# EAGLE board FDT_Main_2021pb2 (EAGLE 7.6.0), part 1 of 2
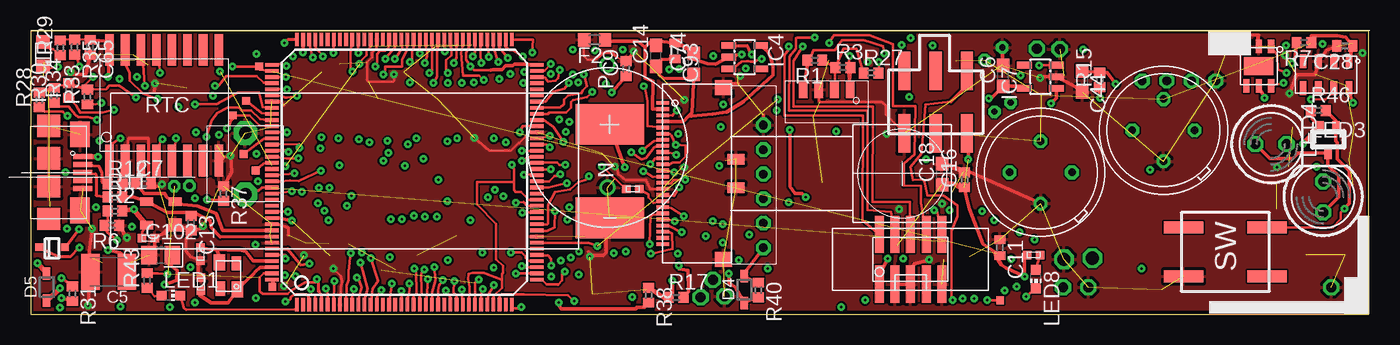
[diagram p5: board, top side]
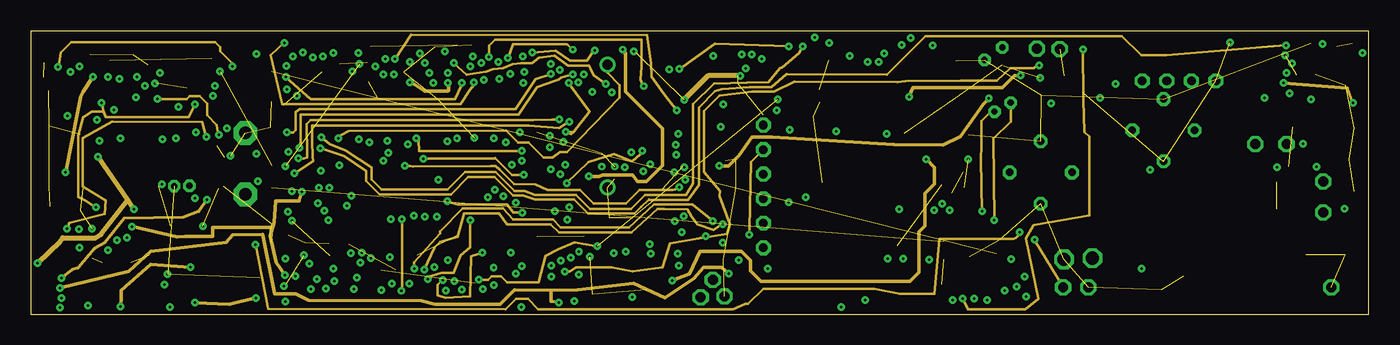
[diagram p6: board, inner layer UpGnd]
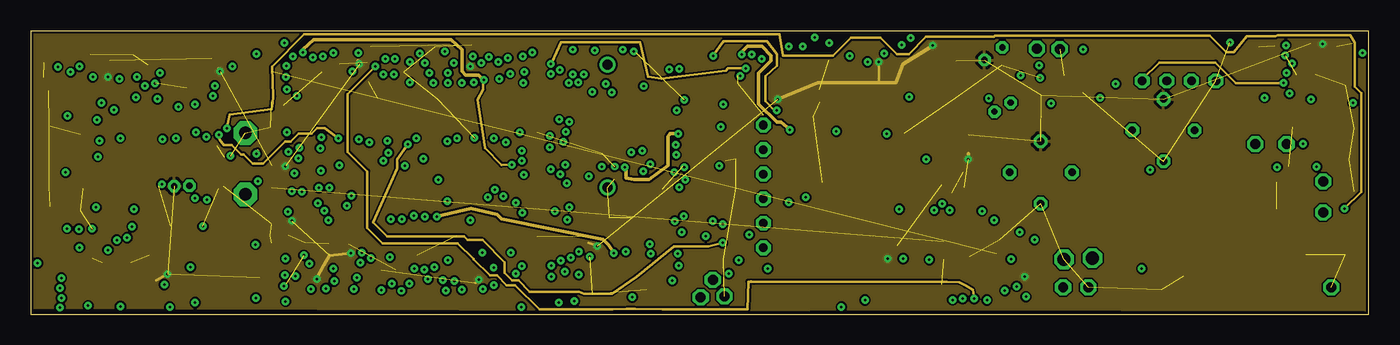
[diagram p7: board, inner layer UpSig]
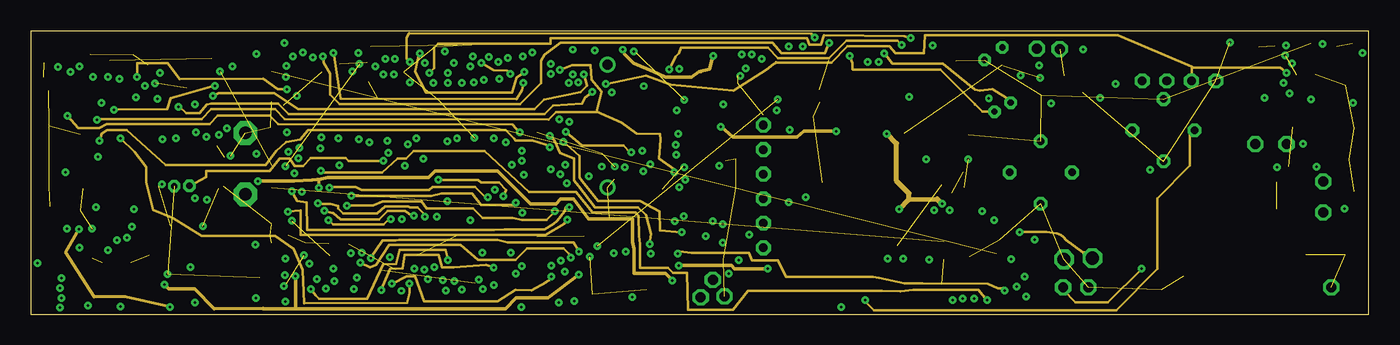
[diagram p8: board, inner layer LoSig]
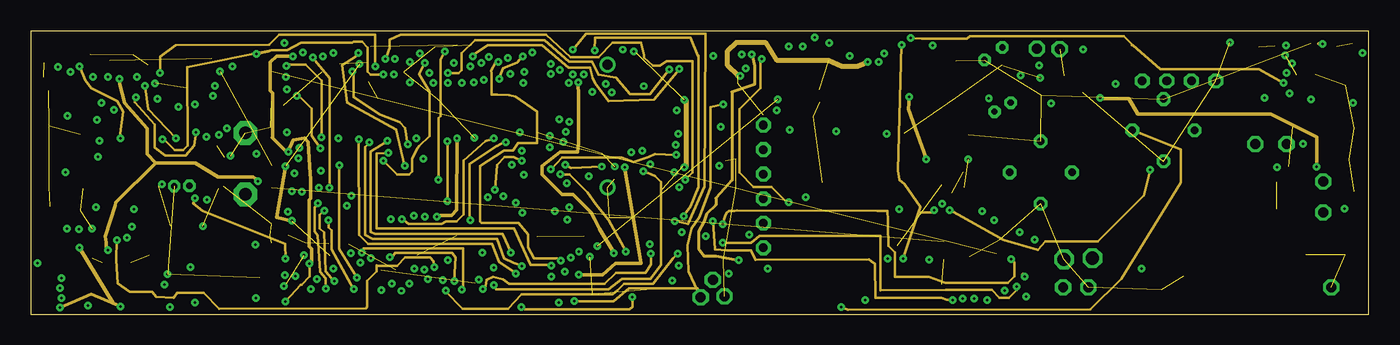
[diagram p9: board, inner layer LoPwr]
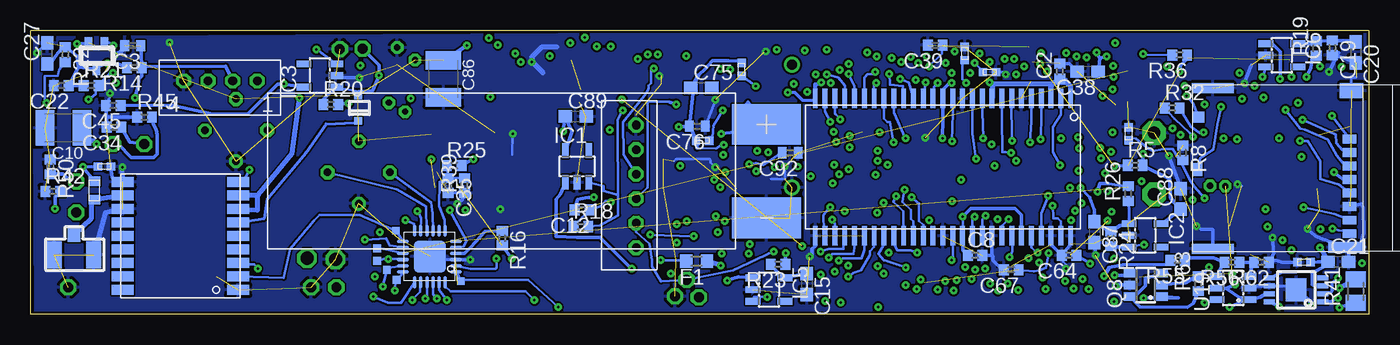
[diagram p10: board, bottom side, seen from below]

Size 108.97 x 23.11 mm. Coordinates in mm from the lower left corner, seen from the top.
Outline: 108.97,0 108.97,23.11 0,23.11 0,0 108.97,0
Copper layers (1*2*3*14*15*16): Top 0.035mm / dielectric 1.5mm / UpGnd 0.035mm / dielectric 1.5mm / UpSig 0.035mm / dielectric 1.5mm / LoSig 0.035mm / dielectric 1.5mm / LoPwr 0.035mm / dielectric 1.5mm / Bottom 0.035mm
Design rules "default *": minimum track width 4mil, minimum drill 8mil, track to track 6mil, track to pad 6mil, pad to pad 6mil, via to via 6mil, smd to smd 2mil, copper to edge 8mil, drill to drill 10mil, minimum pad ring 10mil, minimum via ring 8mil, stop-mask expansion 4mil, vias tented up to drill 0mil, thermal gap 10mil

## Footprints (pad centres in the part's own frame; a part is rotated, then mirrored left to right if it is on the bottom)
BATT_LIPO_SM = smd 5.588 x 3.302: N 2.54,-3.81; P 2.54,3.81
BATT_COIN_BR1225 = drill 0.8: NEG 0,0; PLUS 10,0
C0402 = smd 0.8 x 0.9: 1 -0.6,0; 2 0.6,0
C0402' = smd 0.7 x 0.9: 1 -0.65,0; 2 0.65,0
SMD_0402 = smd 0.686 x 0.686: P$1 -0.533,0; P$2 0.533,0
C1210K = smd 1.5 x 2.9: 1 -1.5,0; 2 1.5,0
C0603 = smd 1.1 x 1: 1 -0.85,0; 2 0.85,0
C0805ELEC = smd 1.3 x 1.5: 1P 0.95,0; 2N -0.95,0
TVSDIODE = smd 1.05 x 1.05: P$1 0,0 | smd 0.7 x 1.05: P$2 1.92,0; P$3 1.92,2.3; P$4 0,2.3
SOD323 = smd 0.625 x 0.625: A -1.1,0; K 1,0
SOD323' = smd 1 x 0.6: 1_K -1.1,0; 2_A 1.1,0
R0603 = smd 1 x 1.1: 1 -0.85,0; 2 0.85,0
GPS_ANTE = smd 2.2 x 1.2: P$1 0,-1.6; P$2 0,1.6 | smd 1.1 x 1: P$3 1.6,0
SOT23-5 = smd 0.55 x 1.2: 1 -0.95,-1.3; 2 0,-1.3; 3 0.95,-1.3; 4 0.95,1.3; 5 -0.95,1.3
JTAG_KINETIS = smd 0.737 x 3.048: P$1 -2.54,-2.032; P$2 -2.54,2.032; P$3 -1.27,-2.032; P$4 -1.27,2.032; P$5 0,-2.032; P$6 0,2.032; P$7 1.27,-2.032; P$8 1.27,2.032; P$9 2.54,-2.032; P$10 2.54,2.032
CONN_FPC_24PIN = smd 0.3 x 1: P1 5.75,0.5; P2 5.25,0.5; P3 4.75,0.5; P4 4.25,0.5; P5 3.75,0.5; P6 3.25,0.5; P7 2.75,0.5; P8 2.25,0.5; P9 1.75,0.5; P10 1.25,0.5; P11 0.75,0.5; P12 0.25,0.5; P13 -0.25,0.5; P14 -0.75,0.5; P15 -1.25,0.5; P16 -1.75,0.5; P17 -2.25,0.5; P18 -2.75,0.5; P19 -3.25,0.5; P20 -3.75,0.5; P21 -4.25,0.5; P22 -4.75,0.5; P23 -5.25,0.5; P24 -5.75,0.5 | smd 0.85 x 1.4: P$25 -1.175,-5.46; P$26 1.175,-5.46 | smd 1.22 x 1.4: P$27 -7,-4.45; P$28 7,-4.45
MICRO_SD_HORIZ = smd 0.7 x 1.1: 1_DAT2 4.45,-1.05; 2_CD_DAT3 5.55,-1.05; 3_CMD 6.65,-1.05; 4_VDD 7.75,-1.05; 5_CLK 8.85,-1.05; 6_VSS 9.95,-1.05; 7_DAT0 11.05,-1.05; 8_DAT1 12.15,-1.05 | smd 1.05 x 0.78: CD1 6.925,-13.44 | smd 0.9 x 0.93: CD2 2.66,-13.365 | smd 1.2 x 1.9: G1 0.5,-0.9 | smd 0.8 x 3.4: G2 0.3,-12.2; G3 13.4,-12.2 | smd 0.9 x 3: G4 13.3,-1.3
USB_MICRO_2019SMT = smd 2.1 x 1.6: G1 -3.1,2.55; G2 3.1,2.55 | smd 1.8 x 1.9: G3 -3.8,0; G4 -1.15,0; G5 1.15,0; G6 3.8,0 | smd 0.4 x 1.55: P1 -1.3,2.775; P2 -0.65,2.775; P3 0,2.775; P4 0.65,2.775; P5 1.3,2.775
HDR_PGM_TINY_SMT = smd 3.15 x 1: 1_VCC -2.54,-2.54; 2_RST_PGM 2.54,-2.54; 3__NC -2.54,0; 4__NC 2.54,0; 5__GND -2.54,2.54; 6__NC 2.54,2.54
CONN_4PCABLE = drill 0.7 octagon: P1 6,0; P2 4,0; P3 2,0; P4 0,0
CONN_6PCABLE = drill 0.7 octagon: P$1 0,0; P$2 2,0; P$3 4,0; P$4 6,0; P$5 8,0; P$6 10,0
SMD_IND = smd 0.762 x 0.94: P$1 -0.762,0; P$2 0.762,0
CHIP-LED0603 = smd 0.8 x 0.8: A 0,-0.75; C 0,0.75
LED_RA_SM = smd 1.1 x 1.1: 1_A -1,0; 2_K 1,0
LED5MM = drill 0.813 octagon: A -1.27,0; K 1.27,0
PIR_4P = drill 0.61 pad 0.864 octagon: DL 2.54,0; SI -2.54,0; VDD 0,2.54; VSS 0,-2.54
SOT23_PFET = smd 0.6 x 1: 1_G 0.65,0.83; 2_S -0.65,0.83; 3_D 0,-1.27
SSOT6 = smd 0.69 x 0.99: 1 -0.95,-1.3; 2 0,-1.3; 3 0.95,-1.3; 4 0.95,1.3; 5 0,1.3; 6 -0.95,1.3
R0402 = smd 0.8 x 0.9: 1 -0.6,0; 2 0.6,0
M0805 = smd 1.3 x 1.6: 1 -0.95,0; 2 0.95,0
SW_SQ = drill 1.016 pad 1.93 octagon: P$1 -2.5,0; P$2 2.5,0
TESTP_SM = drill 0.813 pad 1.321 octagon: P$1 0,0
TP_SMT = smd 0.635 x 0.635: P$1 0,0
TP_THSM = drill 0.508 octagon: P$1 0,0
TP_THSM2 = drill 1.067 pad 1.524 octagon: P$1 0,0
ALTIMETER_MPL = smd 0.55 x 1.15: P$1 -1.875,-1.1; P$2 -0.625,-1.1; P$3 0.625,-1.1; P$4 1.875,-1.1; P$5 1.875,1.1; P$6 0.625,1.1; P$7 -0.625,1.1; P$8 -1.875,1.1
LQFP144 = smd 1.1 x 0.3: P$1 -10.8,8.75; P$2 -10.8,8.25; P$3 -10.8,7.75; P$4 -10.8,7.25; P$5 -10.8,6.75; P$6 -10.8,6.25; P$7 -10.8,5.75; P$8 -10.8,5.25; P$9 -10.8,4.75; P$10 -10.8,4.25; P$11 -10.8,3.75; P$12 -10.8,3.25; P$13 -10.8,2.75; P$14 -10.8,2.25; P$15 -10.8,1.75; P$16 -10.8,1.25; P$17 -10.8,0.75; P$18 -10.8,0.25; P$19 -10.8,-0.25; P$20 -10.8,-0.75; P$21 -10.8,-1.25; P$22 -10.8,-1.75; P$23 -10.8,-2.25; P$24 -10.8,-2.75; P$25 -10.8,-3.25; P$26 -10.8,-3.75; P$27 -10.8,-4.25; P$28 -10.8,-4.75; P$29 -10.8,-5.25; P$30 -10.8,-5.75; P$31 -10.8,-6.25; P$32 -10.8,-6.75; P$33 -10.8,-7.25; P$34 -10.8,-7.75; P$35 -10.8,-8.25; P$36 -10.8,-8.75; P$73 10.8,-8.75; P$74 10.8,-8.25; P$75 10.8,-7.75; P$76 10.8,-7.25; P$77 10.8,-6.75; P$78 10.8,-6.25; P$79 10.8,-5.75; P$80 10.8,-5.25; P$81 10.8,-4.75; P$82 10.8,-4.25; P$83 10.8,-3.75; P$84 10.8,-3.25; P$85 10.8,-2.75; P$86 10.8,-2.25; P$87 10.8,-1.75; P$88 10.8,-1.25; P$89 10.8,-0.75; P$90 10.8,-0.25; P$91 10.8,0.25; P$92 10.8,0.75; P$93 10.8,1.25; P$94 10.8,1.75; P$95 10.8,2.25; P$96 10.8,2.75; P$97 10.8,3.25; P$98 10.8,3.75; P$99 10.8,4.25; P$100 10.8,4.75; P$101 10.8,5.25; P$102 10.8,5.75; P$103 10.8,6.25; P$104 10.8,6.75; P$105 10.8,7.25; P$106 10.8,7.75; P$107 10.8,8.25; P$108 10.8,8.75 | smd 0.3 x 1.1: P$37 -8.75,-10.8; P$38 -8.25,-10.8; P$39 -7.75,-10.8; P$40 -7.25,-10.8; P$41 -6.75,-10.8; P$42 -6.25,-10.8; P$43 -5.75,-10.8; P$44 -5.25,-10.8; P$45 -4.75,-10.8; P$46 -4.25,-10.8; P$47 -3.75,-10.8; P$48 -3.25,-10.8; P$49 -2.75,-10.8; P$50 -2.25,-10.8; P$51 -1.75,-10.8; P$52 -1.25,-10.8; P$53 -0.75,-10.8; P$54 -0.25,-10.8; P$55 0.25,-10.8; P$56 0.75,-10.8; P$57 1.25,-10.8; P$58 1.75,-10.8; P$59 2.25,-10.8; P$60 2.75,-10.8; P$61 3.25,-10.8; P$62 3.75,-10.8; P$63 4.25,-10.8; P$64 4.75,-10.8; P$65 5.25,-10.8; P$66 5.75,-10.8; P$67 6.25,-10.8; P$68 6.75,-10.8; P$69 7.25,-10.8; P$70 7.75,-10.8; P$71 8.25,-10.8; P$72 8.75,-10.8; P$109 8.75,10.8; P$110 8.25,10.8; P$111 7.75,10.8; P$112 7.25,10.8; P$113 6.75,10.8; P$114 6.25,10.8; P$115 5.75,10.8; P$116 5.25,10.8; P$117 4.75,10.8; P$118 4.25,10.8; P$119 3.75,10.8; P$120 3.25,10.8; P$121 2.75,10.8; P$122 2.25,10.8; P$123 1.75,10.8; P$124 1.25,10.8; P$125 0.75,10.8; P$126 0.25,10.8; P$127 -0.25,10.8; P$128 -0.75,10.8; P$129 -1.25,10.8; P$130 -1.75,10.8; P$131 -2.25,10.8; P$132 -2.75,10.8; P$133 -3.25,10.8; P$134 -3.75,10.8; P$135 -4.25,10.8; P$136 -4.75,10.8; P$137 -5.25,10.8; P$138 -5.75,10.8; P$139 -6.25,10.8; P$140 -6.75,10.8; P$141 -7.25,10.8; P$142 -7.75,10.8; P$143 -8.25,10.8; P$144 -8.75,10.8
HUMIDITY_A = smd 0.5 x 1.1: P$1 -1,-1.6; P$2 0,-1.6; P$3 1,-1.6; P$4 1,1.6; P$5 0,1.6; P$6 -1,1.6 | smd 2.4 x 1.5: P$7 0,0
ALS = smd 0.7 x 1.4: P$1 -1.9,0; P$2 -0.635,0; P$3 0.635,0; P$4 1.9,0
SOIC16_RTC = smd 0.7 x 2.6: P$1 -4.445,-4.5; P$2 -3.175,-4.5; P$3 -1.905,-4.5; P$4 -0.635,-4.5; P$5 0.635,-4.5; P$6 1.905,-4.5; P$7 3.175,-4.5; P$8 4.445,-4.5; P$9 4.445,4.5; P$10 3.175,4.5; P$11 1.905,4.5; P$12 0.635,4.5; P$13 -0.635,4.5; P$14 -1.905,4.5; P$15 -3.175,4.5; P$16 -4.445,4.5
TSOP_54 = smd 0.4 x 1.6: P$1 -9.3,-5.6; P$2 -8.5,-5.6; P$3 -7.7,-5.6; P$4 -6.9,-5.6; P$5 -6.1,-5.6; P$6 -5.3,-5.6; P$7 -4.5,-5.6; P$8 -3.7,-5.6; P$9 -2.9,-5.6; P$10 -2.1,-5.6; P$11 -1.3,-5.6; P$12 -0.5,-5.6; P$13 0.3,-5.6; P$14 1.1,-5.6; P$15 1.9,-5.6; P$16 2.7,-5.6; P$17 3.5,-5.6; P$18 4.3,-5.6; P$19 5.1,-5.6; P$20 5.9,-5.6; P$21 6.7,-5.6; P$22 7.5,-5.6; P$23 8.3,-5.6; P$24 9.1,-5.6; P$25 9.9,-5.6; P$26 10.7,-5.6; P$27 11.5,-5.6; P$28 11.5,5.6; P$29 10.7,5.6; P$30 9.9,5.6; P$31 9.1,5.6; P$32 8.3,5.6; P$33 7.5,5.6; P$34 6.7,5.6; P$35 5.9,5.6; P$36 5.1,5.6; P$37 4.3,5.6; P$38 3.5,5.6; P$39 2.7,5.6; P$40 1.9,5.6; P$41 1.1,5.6; P$42 0.3,5.6; P$43 -0.5,5.6; P$44 -1.3,5.6; P$45 -2.1,5.6; P$46 -2.9,5.6; P$47 -3.7,5.6; P$48 -4.5,5.6; P$49 -5.3,5.6; P$50 -6.1,5.6; P$51 -6.9,5.6; P$52 -7.7,5.6; P$53 -8.5,5.6; P$54 -9.3,5.6
MSOP_8 = smd 0.42 x 0.89: P$1 -0.975,-2.175; P$2 -0.325,-2.175; P$3 0.325,-2.175; P$4 0.975,-2.175; P$5 0.975,2.175; P$6 0.325,2.175; P$7 -0.325,2.175; P$8 -0.975,2.175 | smd 1.88 x 1.68: P$9 0,0
UBLOX_M8 = smd 1.8 x 0.8: P$1 -4.7,4.4; P$2 -4.7,3.3; P$3 -4.7,2.2; P$4 -4.7,1.1; P$5 -4.7,0; P$6 -4.7,-1.1; P$7 -4.7,-2.2; P$8 -4.7,-3.3; P$9 -4.7,-4.4; P$10 4.7,-4.4; P$11 4.7,-3.3; P$12 4.7,-2.2; P$13 4.7,-1.1; P$14 4.7,0; P$15 4.7,1.1; P$16 4.7,2.2; P$17 4.7,3.3; P$18 4.7,4.4
SOT23-6L = smd 0.55 x 1.2: 1 -0.95,-1.3; 2 0,-1.3; 3 0.95,-1.3; 4 0.95,1.3; 5 0,1.3; 6 -0.95,1.3
QFN24 = smd 1 x 0.3: P$1 -2.1,1.25; P$2 -2.1,0.75; P$3 -2.1,0.25; P$4 -2.1,-0.25; P$5 -2.1,-0.75; P$6 -2.1,-1.25; P$13 2.2,-1.25; P$14 2.2,-0.75; P$15 2.2,-0.25; P$16 2.2,0.25; P$17 2.2,0.75; P$18 2.2,1.25 | smd 0.3 x 1: P$7 -1.25,-2.1; P$8 -0.75,-2.1; P$9 -0.25,-2.1; P$10 0.25,-2.1; P$11 0.75,-2.1; P$12 1.25,-2.1; P$19 1.25,2.1; P$20 0.75,2.1; P$21 0.25,2.1; P$22 -0.25,2.1; P$23 -0.75,2.1; P$24 -1.25,2.1 | smd 2.6 x 2.6: P$25 0,0
SWITCH = smd 1 x 3.2: P$1 -2,3.4; P$2 -2,-3.4; P$3 2,-3.4; P$4 2,3.4
XTAL_SMALL = smd 1.3 x 0.95: P$1 -1.1,-0.725; P$3 1.1,0.725 | smd 1.15 x 0.8: P$2 1.025,-0.65; P$4 -1.025,0.65

## Placement (x,y rotation side)
B1  BATT_LIPO_SM  [BATT_LIPO_SM]  44.6,11.66 0 top
B2  BATT_COIN_BR1225  [BATT_COIN_BR1225]  46.96,10.34 90 top
B3  BATT_LIPO_SM  [BATT_LIPO_SM]  51.59,11.66 0 bottom
C2  0.1uF  [C0402]  25.17,19.81 90 bottom
C3  0.1uF  [C0402']  100.66,21.89 180 bottom
C4  10pF  [SMD_0402]  19.56,14.71 90 bottom
C5  220uF  [C1210K]  6.35,3.45 180 top
C6  DNS_10uF  [C0603]  79.2,19.43 90 top
C7  47pF  [C0402]  9.19,10.64 0 top
C8  0.1uF  [C0402]  32.05,4.8 0 bottom
C9  0.1uF  [C0402]  48.49,20.02 90 top
C10  DNS_220uF_flash  [C1210K]  106.3,15.19 180 bottom
C11  0.1uF  [C0402']  78.92,5.44 270 top
C12  0.1uF  [C0402]  64.08,8.51 180 bottom
C13  47pF  [C0402]  13.06,7.42 270 top
C14  10uF  [C0603]  50.93,21.06 90 top
C15  10uF  [C0603]  45.77,2.46 270 bottom
C16  0.1uF  [C0402]  76.05,10.95 90 top
C18  10uF  [C0603]  74.22,11.4 90 top
C19  0.1uF  [C0402]  2.97,21.72 270 bottom
C20  10uF  [C0603]  1.07,21.34 270 bottom
C21  2.2uF  [C0603]  2.49,4.27 0 bottom
C22  0.1uF  [C0402]  106.48,18.64 180 bottom
C27  1.0uF  [C0603]  107.62,21.26 90 bottom
C28  0.1uF  [C0402']  107.01,21.87 180 top
C29  0.1uF  [SMD_0402]  5.28,4.24 180 bottom
C34  0.1uF  [C0402]  102.18,15.24 180 bottom
C35  0.1uF  [C0402]  74.96,10.49 270 bottom
C38  4.7Uf  [C0603]  22.89,19.78 180 bottom
C39  0.1uF  [C0402]  35.31,21.92 180 bottom
C43  18pF  [SMD_0402]  102.97,12.04 180 bottom
C44  10uF  [C0603]  85.62,18.97 270 top
C45  0.1uF  [C0402]  102.23,17.02 180 bottom
C64  0.1uF  [C0402]  24.4,4.81 180 bottom
C65  0.1uF  [C0402]  4.85,21.76 270 top
C67  0.1uF  [C0402]  29.12,3.62 180 bottom
C70  10pF  [SMD_0402]  13.87,2.45 90 top
C71  10pF  [SMD_0402]  13.82,4.89 270 top
C74  1uF  [C0603]  54,20.42 90 top
C75  1uF  [C0603]  54.36,18.45 0 bottom
C76  0.1uF  [C0402']  54.68,15.33 180 bottom
C86  220uF  [C1210K]  75.36,19.18 270 bottom
C87  10uF  [C0603]  22.35,6.68 270 bottom
C88  10uF  [C0603]  15.32,9.4 90 bottom
C89  10uF  [C0603]  64.59,16.13 0 bottom
C92  0.1uF  [C0402']  47.12,13.16 180 bottom
C93  0.1uF  [C0402']  52.45,21.46 270 top
C102  10uF  [C0805ELEC]  10.59,4.83 0 top
C155  10nF  [SMD_0402]  9.58,6.2 0 top
D1  ESD_SM  [TVSDIODE]  11.76,7.26 90 top
D2  DIO_SCH  [SOD323]  82.3,16.76 270 bottom
D3  DIO_SCH  [SOD323]  1.7,5.46 180 top
D4  DIODE_SCHTKY  [SOD323']  58.12,2.01 90 top
D5  DIODE_SCHTKY  [SOD323']  1.3,2.21 90 top
F1  [R0603]  54.74,4.32 180 bottom
F2  [R0603]  45.92,22.38 180 top
G2  GPS_ANT  [GPS_ANTE]  105.44,4.85 90 bottom
IC1  3.0  [SOT23-5]  64.48,12.05 0 bottom
IC2  3.3  [SOT23-5]  18.21,6.43 270 bottom
IC3  3.3  [SOT23-5]  85.42,19.46 90 bottom
IC4  2.8  [SOT23-5]  58.14,20.95 270 top
IC5  3.3  [SOT23-5]  48.84,2.01 270 bottom
IC6  3.3  [SOT23-5]  7.09,21.11 270 bottom
IC7  DNS_3.0  [SOT23-5]  82.22,19.35 90 top
J1  JTAG_KINETIS  [JTAG_KINETIS]  71.65,4.47 0 top
J2  CONN_FPC_24P  [CONN_FPC_24PIN]  51.97,11.47 90 top
J3  MICRO_SD_HORIZ  [MICRO_SD_HORIZ]  0.51,18.73 270 bottom
J4  USB_MICRO_SMT  [USB_MICRO_2019SMT]  1.47,11.56 270 top
J5  HDR_PGM_TINY_SMT  [HDR_PGM_TINY_SMT]  73.69,17.29 90 top
J6  CONN_4PCABLE_VERT  [CONN_4PCABLE]  96.52,19.02 0 bottom
J7  CONN_6P_VERT  [CONN_6PCABLE]  59.66,15.42 270 bottom
L5  100nH  [SMD_IND]  103.78,10.08 270 bottom
LED1  [CHIP-LED0603]  11.43,1.52 270 top
LED2  LED_RA_SM  [LED_RA_SM]  1.02,21.18 270 top
LED3  [LED5MM]  101,13.86 0 top
LED4  [LED5MM]  105.25,9.56 90 top
LED8  [CHIP-LED0603]  81.86,2.87 180 top
PIR1  PIR_DUAL_4P  [PIR_4P]  92.25,15 0 top
PIR2  PIR_DUAL_4P  [PIR_4P]  82.25,11.56 0 top
Q1  MOSFET_P  [SOT23_PFET]  105.64,14.43 0 top
Q5  MOSFET_P  [SOT23_PFET]  103.61,21.26 0 bottom
Q8  FET_PAIR  [SSOT6]  18.16,2.39 90 bottom
R1  4.7K  [R0402]  63.86,20.7 180 top
R2  DNS_1M  [R0402]  6.86,8.41 0 top
R3  4.7K  [R0402]  66.14,20.12 0 top
R5  0  [R0402]  19.02,12.14 0 bottom
R6  DNS_2.2M  [R0402]  6.6,7.24 180 top
R7  0  [R0402]  103.68,22.15 180 top
R8  5.62K_1%  [R0402]  15.14,13.16 270 bottom
R9  2.7K  [SMD_0402]  54.25,14.15 0 bottom
R10  2.7K  [SMD_0402]  51.08,19.96 270 bottom
R11  27  [R0402]  6.86,9.55 0 top
R12  27  [R0402]  6.88,10.62 0 top
R13  27  [SMD_0402]  49.02,10.21 180 top
R14  0  [R0402]  100.53,20.12 180 bottom
R15  0  [R0402]  87.05,19.1 90 top
R16  0  [R0402]  70.56,6.2 270 bottom
R17  0  [R0402]  52.55,1.37 0 top
R18  100  [R0402]  64.16,7.14 0 bottom
R19  0  [R0402]  4.29,21.67 90 bottom
R20  DNS_0  [R0402]  84.53,17.09 0 bottom
R21  4.7K  [R0402]  104.04,18.64 0 bottom
R22  4.7K  [R0402]  106.15,21.16 270 bottom
R23  0  [R0402]  48.11,4.06 180 bottom
R24  10K  [R0402]  21.01,6.15 270 bottom
R25  1.5M  [R0402]  74.47,12.12 0 bottom
R26  0  [R0402]  19.58,9.83 90 bottom
R27  0  [R0402]  68.43,19.66 0 top
R28  100K  [R0402]  0.71,17.48 90 top
R29  330  [R0402]  2.41,21.72 90 top
R30  100K  [R0402]  1.91,17.86 90 top
R31  10K  [R0402]  3.4,1.68 270 top
R32  100K  [R0402]  16,16.81 0 bottom
R33  100K  [R0402]  4.62,17.7 90 top
R34  10K  [R0402]  3.1,18.24 90 top
R35  4.7K  [R0402]  3.58,21.77 270 top
R36  4.7K  [R0402]  15.39,21.13 180 bottom
R37  10K_NTC  [R0402]  15.7,9.83 270 top
R38  0  [R0402]  50.32,1.55 270 top
R39  2.2M  [R0402]  73.64,10.49 90 bottom
R40  0  [R0402]  59.26,1.98 270 top
R41  7.5_0p25W_0805  [M0805]  1.07,1.88 90 bottom
R42  20  [R0402]  107.16,10.01 0 bottom
R43  330  [R0402]  9.48,2.75 90 top
R44  1K  [SMD_0402]  32.9,21.24 270 bottom
R45  20  [R0402]  99.69,16.05 0 bottom
R46  1M  [R0402]  104.85,16.61 0 top
R50  20  [R0402]  107.37,12.01 270 bottom
R53  1K  [SMD_0402]  30.89,19.73 180 bottom
R55  360K  [R0402]  15.57,4.39 180 bottom
R56  510K  [R0402]  11.15,4.24 180 bottom
R62  110K  [R0402]  8.74,4.24 180 bottom
R63  1M  [R0402]  13.89,2.49 90 bottom
R65  330  [SMD_0402]  81.66,4.83 0 top
SW1  SWITH_NO  [SW_SQ]  17.48,12.27 90 top
T2  [TESTP_SM]  105.91,2.18 90 top
T3  [TESTP_SM]  86.13,2.18 0 top
T4  [TESTP_SM]  54.56,1.37 90 top
T5  [TESTP_SM]  56.49,1.46 0 top
T6  [TESTP_SM]  84.07,2.18 0 top
T7  [TESTP_SM]  55.55,2.79 0 top
T12  [TESTP_SM]  83.79,21.62 0 top
T13  [TESTP_SM]  81.94,21.64 0 bottom
TP1  TP_SMT  [TP_SMT]  17.55,17.4 0 top
TP2  TP_SMT  [TP_SMT]  79.22,6.81 0 bottom
TP3  TP_THSM  [TP_THSM]  78.49,16.51 0 top
TP4  TP_SMT  [TP_SMT]  80.75,5.36 0 bottom
TP5  TP_THSM  [TP_THSM]  77.67,20.73 0 top
TP6  TP_SMT  [TP_SMT]  73.94,2.69 0 bottom
TP7  TP_THSM  [TP_THSM]  12.93,10.46 0 top
TP8  TP_THSM  [TP_THSM]  79.12,21.74 0 top
TP9  TP_THSM  [TP_THSM]  11.68,10.44 0 top
TP10  TP_SMT  [TP_SMT]  19.68,2.24 0 top
TP11  TP_THSM  [TP_THSM]  79.81,17.25 0 top
TP12  TP_THSM2  [TP_THSM2]  84.15,4.47 0 top
TP13  TP_THSM2  [TP_THSM2]  86.46,4.57 0 top
TP15  TP_SMT  [TP_SMT]  18.31,11.71 0 top
TP16  TP_SMT  [TP_SMT]  16.46,16.21 0 top
TP17  TP_SMT  [TP_SMT]  17.35,13.06 0 top
TP18  TP_SMT  [TP_SMT]  18.59,20.19 0 top
TP24  TP_SMT  [TP_SMT]  79.96,3.61 0 bottom
TP26  TP_SMT  [TP_SMT]  79.17,2.79 90 bottom
TP27  TP_SMT  [TP_SMT]  80.75,4.34 0 bottom
TP29  TP_SMT  [TP_SMT]  78.94,1.14 0 top
U1  ALTIMETER_NXP  [ALTIMETER_MPL]  105.49,19.53 180 top
U2  ATSAMV71_144  [LQFP144]  30.43,11.58 90 top
U4  HUMIDITY_A  [HUMIDITY_A]  100,20.22 180 top
U5  ALS  [ALS]  64.82,18.31 180 top
U6  RTC_2019  [SOIC16_RTC]  10.87,17.04 0 top
U7  SRAM_16M_2X16  [TSOP_54]  33.58,11.99 180 bottom
U9  [MSOP_8]  5.92,1.98 90 bottom
U11  UBLOX_M8  [UBLOX_M8]  96.77,6.38 180 bottom
U19  LTC1998  [SOT23-6L]  11.05,2.13 90 bottom
U24  ATTINY_817_QFN  [QFN24]  76.45,4.7 180 bottom
U$1  [SWITCH]  97.28,5.08 90 top
X3  12MHz  [XTAL_SMALL]  16.11,3.11 90 top

## Tracks (layer width: path | path; a pad name or v marks a point on that pad's centre or on a via)
A0  (via drill 0.2 pad 0.46)
  Top 0.203: v20.85,14.83 U2.P$120
  UpGnd 0.203: v42.37,19.58 41.12,19.18 39.47,16.74 21.89,16.74 21.57,16.48 21.57,15.01 21.36,14.81 20.88,14.81 v20.85,14.83
  Bottom 0.203: U7.P$23 41.88,18.61 v42.37,19.58
A1  (via drill 0.2 pad 0.46)
  Top 0.203: v21.87,13.56 21.87,13.87 19.64,13.84 U2.P$122
  UpGnd 0.203: v44.15,19.56 43.2,19.3 43,19.13 42.75,19.05 41.25,18.49 39.73,16.26 21.97,16.26 22,14.05 21.89,13.64 v21.87,13.56
  Bottom 0.203: U7.P$24 42.68,18.55 42.65,18.64 43.18,19.3 v44.15,19.56
A2  (via drill 0.2 pad 0.46)
  Top 0.203: v21.79,12.7 20.88,12.68 19.65,12.85 U2.P$124
  UpGnd 0.203: v43.03,15.88 42.44,15.85 40.89,15.82 22.81,15.82 22.45,15.52 22.45,14.3 22.5,14.2 22.53,12.78 22.23,12.7 22,12.65 v21.79,12.7
  Bottom 0.203: U7.P$25 43.48,16.55 43.48,16.36 43.41,16.26 v43.03,15.88
A3  (via drill 0.2 pad 0.46)
  Top 0.203: v21.49,11.48 19.66,11.3 U2.P$127
  UpGnd 0.203: v43.84,15.7 43.03,15.19 40.54,15.37 22.91,15.37 22.91,14.1 22.96,12.85 22.99,12.47 v21.49,11.48
  Bottom 0.203: U7.P$26 44.28,16.52 v43.84,15.7
A4_SPICLK1  (via drill 0.2 pad 0.46)
  Top 0.203: v21.26,10.01 U2.P$130
  LoSig 0.203: v43.87,8.74 43.59,8.74 43.48,8.38 42.88,7.62 42.57,7.34 41.83,6.91 38.61,6.91 37.74,6.88 22.53,6.88 22.48,9.09 21.72,9.25 v21.26,10.01
  Bottom 0.203: U7.P$29 44.35,7.31 44.4,7.54 44.4,8.08 v43.87,8.74
A5_CPICS  (via drill 0.2 pad 0.46)
  Top 0.203: v20.95,8.36 19.65,8.36 U2.P$133
  LoSig 0.203: v43.71,7.7 43.61,7.62 43.56,7.54 43.43,7.34 41.94,6.45 38.79,6.45 37.87,6.48 22,6.48 22,8.46 v20.95,8.36
  Bottom 0.203: U7.P$30 43.48,6.98 43.46,7.37 43.69,7.64 v43.71,7.7
A6_MISO1  (via drill 0.2 pad 0.46)
  Top 0.203: v27.69,4.57 28.3,2.72 27.84,2.06 U2.P$13
  LoSig 0.203: v44.65,5.11 44.22,5.87 38.84,5.87 38.02,6.07 30,6.07 29.72,6.02 28.65,6.02 v27.69,4.57
  Bottom 0.203: U7.P$31 42.78,6.13 42.8,5.31 43.97,5.31 v44.65,5.11
A7_MOSI  (via drill 0.2 pad 0.46)
  Top 0.203: v26.85,4.19 27.43,2.08 27.23,1.37 U2.P$12
  LoSig 0.203: v43.97,4.6 43.84,4.93 43.38,5.38 40.44,5.38 39.5,4.45 39.4,4.42 36.45,4.42 35.03,5.64 29.18,5.64 28.12,4.01 27.64,3.83 v26.85,4.19
  Bottom 0.203: U7.P$32 41.88,5.39 41.99,4.93 43.69,4.93 v43.97,4.6
A8  (via drill 0.2 pad 0.46)
  Top 0.203: v38.08,20.57 37.69,21.71 U2.P$76
  LoPwr 0.203: v43.18,4.37 42.88,4.55 40.97,4.55 40.51,5.44 40.51,6.5 39.73,7.44 36.7,7.44 36.6,7.54 36.6,12.09 38.53,13.36 39.29,13.36 39.7,13.97 41.25,13.97 41.25,16.54 39.5,17.75 38.94,17.86 38,17.88 37.52,17.91 37.52,19.63 37.49,19.84 37.87,20.5 v38.08,20.57
  Bottom 0.203: U7.P$33 41.08,5.25 41.3,4.55 42.82,4.55 v43.18,4.37
A9  (via drill 0.2 pad 0.46)
  Top 0.203: v29.41,2.49 29.16,0.8 U2.P$16
  LoSig 0.203: v42.39,3.05 42.44,2.92 41.81,2.52 41.99,2.59 40.79,1.96 39.5,2.01 38.02,1.07 32.03,1.07 31.32,3.1 30.61,3.1 v29.41,2.49
  Bottom 0.203: U7.P$34 40.28,5.47 40.64,5.11 40.64,4.83 41.38,3.56 41.96,3.38 v42.39,3.05
A10  (via drill 0.2 pad 0.46)
  Top 0.203: v31.67,21.26 U2.P$88
  LoSig 0.203: v40.21,19.74 39.57,19.3 39.19,18.06 32.21,18.06 31.32,19.76 31.52,20.7 v31.67,21.26
  Bottom 0.203: U7.P$22 41.08,19.3 40.82,19.56 40.34,19.56 v40.21,19.74
A11  (via drill 0.2 pad 0.46)
  Top 0.203: v28.55,1.98 28.22,1.45 28.19,0.82 28.22,0.82 U2.P$14
  LoSig 0.203: v37.69,3.81 37.08,4.01 34.42,3.81 33.5,3.81 33.22,4.83 30.45,4.83 30.28,3.73 29.26,3.71 v28.55,1.98
  Bottom 0.203: U7.P$35 39.53,5.61 39.93,4.93 39.73,4.67 39.47,4.39 39.42,4.39 v37.69,3.81
A12  (via drill 0.2 pad 0.46)
  Top 0.203: v33.55,2.77 33.27,2.34 33.17,1.93 33.22,0.83 U2.P$24
  UpGnd 0.203: v36.78,5 36.07,4.8 35.87,4.72 35.79,1.47 33.78,1.32 33.12,1.52 33.12,2.39 v33.55,2.77
  Bottom 0.203: U7.P$36 38.6,5.56 38.38,5.21 37.29,5.21 v36.78,5
AGND  (via drill 0.2 pad 0.46)
  Top 0.305: 52.23,22.19 C93.1 | J2.P2 50.72,16.71 50.65,16.74 50.67,19 50.01,19.25 50.01,21.77 | 50.01,21.77 50.43,22.19 50.8,22.19 C14.2 50.91,22.29 C93.1 | 46.85,22.28 49.4,22.28 50.01,21.77 | v57.91,21.18 57.91,21.26 57.81,21.16 57.63,21.16 IC4.2 55.77,20.4 55.12,20.42 53.87,20.83 C74.2 52.45,22.3 C93.1 | v61.82,15.04 61.82,10.41 62.26,9.86 62.79,9.86 v63.12,9.53
  Top 0.406: F2.1 46.99,22.42 46.85,22.28
  UpSig 0.305: v57.91,21.18 57.91,21.39 58.37,21.84 59.54,21.84 60.3,21.08 60.3,20.65 59.28,19.63 59.28,17.14 60.78,15.65 61.09,15.65 v61.82,15.04
  Bottom 0.305: v63.12,9.53 63.52,9.53 63.83,9.47 64.41,9.34 C12.2
ALT_PWRC  (via drill 0.2 pad 0.46)
  Top 0.203: U2.P$114 20.45,17.78 20.7,17.66 20.83,17.66 v21.67,17.78
  UpGnd 0.203: v102.21,21.92 92.48,21.11 90.45,21.11 88.88,22.68 72.87,22.68 69.72,19.53 61.57,19.56 61.54,19.56 60.33,18.52 58.55,18.52 56.31,18.36 55.73,18.19 54.41,16.84 54.41,10.52 53.54,9.32 50.39,9.32 50.37,9.35 49.68,8.74 49.71,8.74 49.17,8.2 45.39,8.2 44.25,9.35 41.07,9.35 40.11,9.68 39.27,9.68 37.77,11.18 35.64,11.18 34.21,9.75 28.42,9.75 27.33,10.85 27.33,11.68 25.53,12.88 v23.57,13.54
  LoPwr 0.203: v21.67,17.78 21.87,17.78 22.89,16.76 22.89,14.55 v23.57,13.54
  Bottom 0.203: Q5.1_G 102.58,22.11 v102.21,21.92
BA0  (via drill 0.2 pad 0.46)
  Top 0.203: v32.36,2.87 U2.P$22
  UpGnd 0.203: v35.79,7.67 35.79,5.46 35,4.78 34.44,3.38 33.45,3.38 32.36,3.05 v32.36,2.87
  LoPwr 0.203: v38.71,14.02 38.56,14.02 37.97,13.72 37.95,13.72 35.74,12.24 35.74,7.72 v35.79,7.67
  Bottom 0.203: U7.P$20 39.48,15.96 39.19,15.67 38.99,15.67 v38.71,14.02
BATT  (via drill 0.2 pad 0.46)
  Top 0.254: D3.A v3.94,6.93
  Top 0.305: C102.1P 11.21,4.1 11.91,3.58 11.89,2.77 v10.87,2.41 | B1.P v48.36,11.96
  UpSig 0.305: v52.73,14.71 52.07,14.71 51.89,14.48 51.89,12.14 50.37,11 49.12,11 48.48,11.1 48.48,11.81 v48.36,11.96
  LoSig 0.254: v11.33,0.58 7.7,1.42 5.16,1.4 2.87,5.03 v3.94,6.93
  LoSig 0.305: v44.63,3.23 42.11,1.32 39.52,1.32 38.68,0.43 21.64,0.43 | 21.64,0.43 18.95,0.43 18.95,0.48 14.96,0.46 13.34,2.08 11.23,2.08 v10.87,2.41 | v21.57,3.1 21.57,0.56 21.64,0.43
  LoPwr 0.305: v48.36,11.96 49.68,4.14 47.62,4.14 46.58,3.23 v44.63,3.23
  Bottom 0.305: U19.1 8.88,1.39 8.38,1.68 8.33,1.65 U9.P$7 | v11.33,0.58 10.49,0.91 10.52,1.26 9.78,1.22 U19.1 | U19.5 11.58,2.06 | 11.58,2.06 10.49,1.32 9.46,1.32 U19.1 | v10.87,2.41 11.63,2.11 11.58,2.06 | R55.2 16.31,4.06 20.02,4.04 21.13,3.81 v21.57,3.1 | B3.P 50.57,17.27 51.56,15.93 51.61,14.83 v52.73,14.71
BATT1  (via drill 0.2 pad 0.46)
  Top 0.305: Q1.2_S 104.34,15.9 104.34,16.52 R46.1
  Top 0.406: v103.61,13.89 103.62,13.89 Q1.2_S
  Bottom 0.406: C10.1 104.8,14.25 104.7,14.15 103.86,14.15 v103.61,13.89
BIG_TINY_CLK  (via drill 0.2 pad 0.46)
  Top 0.203: U2.P$128 20.26,10.83 21.11,10.9 21.82,10.87 v23.65,11.71 | TP29.P$1 v77.88,1.14
  LoSig 0.203: v23.65,11.71 23.65,11.63 23.75,11.56 28.6,11.56 29.9,12.7 30.56,12.7 31.17,13.31 36.96,13.31 40.59,9.96 44.42,9.96 45.77,8.31 49.25,8.31 49.48,8.03 49.53,6.38 49.61,5.71 49.61,3.79 51.92,3.79 52.3,3.35 53.44,3.35 53.52,0.36 57.2,0.36 58.42,1.91 69.32,1.91 70.84,1.88 71.88,2.01 75.64,2.01 77.19,1.98 77.85,1.12 v77.88,1.14
  Bottom 0.203: v77.88,1.14 77.88,1.22 77.27,1.83 77.27,2.54 U24.P$20
BIG_TINY_DAT  (via drill 0.2 pad 0.46)
  Top 0.203: U2.P$21 31.68,1.45 31.85,1.63 31.85,2.52 31.77,2.72 31.77,3.23 31.85,3.38 v32.05,3.63
  UpGnd 0.203: v32.05,3.63 32.89,5.44 33.35,5.89 34.75,6.3 35.31,8.23 38.15,8.23 38.79,7.32 42.32,7.32 43.03,6.68 48.92,6.68 51.03,8.59 51.59,8.59 53.49,8.56 53.82,7.98 54.3,7.32 55.6,6.88 v56.34,7.34
  LoPwr 0.203: v56.34,7.34 56.36,7.32 56.44,7.49 56.46,7.72 56.54,7.98 56.64,8.26 56.84,8.43 57.33,8.43 57.53,8.46 69.34,8.43 | 69.34,8.43 68.94,8.43 | 69.34,8.43 69.75,8.43 69.83,7.67 69.83,7.24 69.85,5.59 70.38,5.05 70.38,3.05 73.13,3.05 74.47,2.54 79.58,2.54 80.11,3.07 80.11,4.22 v79.83,4.5
  Bottom 0.203: U24.P$16 78.7,4.5 v79.83,4.5 79.93,4.6 80.7,4.34 80.82,4.42 TP27.P$1
C_HSYNC  (via drill 0.2 pad 0.46)
  Top 0.203: J2.P9 52.47,13.08 v52.55,12.98 | v42.37,11.81 41.25,11.81 U2.P$55
  LoPwr 0.203: v52.55,12.98 50.83,13.06 50.29,12.83 49.07,12.42 48.11,12.78 43.26,12.78 v42.37,11.81
C_PWRC_D  (via drill 0.2 pad 0.46)
  Top 0.203: U2.P$46 42.03,7.33 42.11,7.42 42.11,8.89 42.7,9.96 43.92,10.16 44.63,10.79 45.19,10.92 v45.47,11.23
  UpGnd 0.305: v45.47,11.23 46.28,11.23 46.58,11.35 49,11.35 49.43,10.82 50.14,10.82 51.46,12.14 51.46,15.11 48.44,18.14 48.44,21.23 v48.23,21.57
  UpSig 0.203: v60.76,16.64 60.71,16.48 59.82,17.37 59.82,19.41 60.76,20.27 60.76,21.21 59.94,22.25 56.41,22.25 v55.58,21.06
  LoSig 0.203: 48.36,21.18 v48.23,21.57
  LoSig 0.305: 54.59,19.79 54.42,19.79 | 54.42,19.79 53.82,19.33 51.71,19.33 50.7,19.76 49.1,20.45 48.36,21.18 | v55.58,21.06 55.27,19.96 54.42,19.79
  Bottom 0.203: R18.2 62.59,7.24 61.14,8.05 61.14,9.73 | 61.14,9.73 62.33,10.06 62.33,10.45 IC1.3 | 61.14,9.73 61.14,11.96 61.16,12.9 61.16,15.82 v60.76,16.64
C_PWRDN  (via drill 0.2 pad 0.46)
  Top 0.203: J2.P8 50.94,13.68 50.75,13.59 50.49,13.26 50.11,12.72 49.73,12.6 v48.92,13.18 | v43.81,18.85 43.48,18.39 42.57,18.16 41.94,17.32 U2.P$66
  UpGnd 0.203: 44.21,14.86 v43.59,14.86 44.02,14.66 44.21,14.86 | 44.21,14.86 45.49,16.54 v43.81,18.85
  LoSig 0.203: v48.92,13.18 48.82,13.18 48.26,13.74 44.88,13.74 v43.59,14.86
C_TCK0  (via drill 0.2 pad 0.46)
  Top 0.203: J2.P5 50.23,15.33 50.22,17.37 50.01,18.41 v49.91,18.59 | v37.31,20.95 37.29,21.46 37.21,21.61 37.21,22.35 U2.P$77
  UpGnd 0.203: v49.91,18.59 49.84,18.67 49.76,18.92 49.66,19.13 49.76,20.17 49.76,22.38 37.82,22.38 37.34,21.89 v37.31,20.95
  Bottom 0.203: R10.P$2 v49.91,18.59
C_TWD0  (via drill 0.2 pad 0.46)
  Top 0.203: J2.P3 52.27,16.2 v52.6,16.64 | v29.67,20.8 30.15,21.57 30.23,21.64 30.23,22.34 U2.P$91
  UpGnd 0.203: v52.6,16.64 51.59,17.93 50.57,19.38 50.52,20.47 50.19,22.73 30.96,22.78 v29.67,20.8
  Bottom 0.203: v52.6,16.64 53.37,15.39 53.44,14.45 53.72,14.45 R9.P$2
C_VSYNC  (via drill 0.2 pad 0.46)
  Top 0.203: J2.P7 50.74,14.1 v49.78,13.34 | v43.64,10.69 42.19,10.34 U2.P$52
  UpGnd 0.203: v49.78,13.34 49.63,13.01 49,12.47 48.87,12.47 47.5,13.06 45.44,12.42 v43.64,10.69
CAM_2V8_AVDD
  Top 0.305: 52.17,15.72 J2.P4 53.16,15.72 53.58,16.14 | 51.18,20.32 51.18,20.64 51.41,20.74 C93.2 | 51.18,20.32 51.18,19.53 51.53,19.19 53.67,19.23 53.99,19.55 C74.1 53.87,16.43 53.58,16.14 | IC4.5 59.99,21.45 60.2,21.08 60.43,20.27 60.43,19.51 58.04,17.35 56.67,16.46 56.34,16.43 55.52,16.33 53.81,16.14 53.58,16.14 | C14.1 51.04,20.32 51.18,20.32
CAM_3V0_DOVDD  (via drill 0.2 pad 0.46)
  Top 0.203: J2.P6 52.05,14.68 52.17,14.58 v52.53,13.82 53.31,13.77 53.31,12.85 52.83,12.37 52.27,12.37 51.98,12.18 J2.P11
  LoSig 0.305: v65.61,14.91 62.97,14.91 62.38,14.43 57.17,14.43 v56.21,15.29
  Bottom 0.203: v52.53,13.82 52.83,13.69 53.16,13.51 54.71,13.54 | R10.P$1 51.26,20.5 51.26,20.62
  Bottom 0.305: C76.2 55.12,14.96 R9.P$1 54.71,14.15 54.71,13.54 | C76.2 54.98,18.4 C75.1 54.55,19.53 54.05,19.96 53.44,20.66 52.13,20.68 51.26,20.62 51.26,20.64 | IC1.5 64.87,14.89 C89.1 v65.61,14.91 | v56.21,15.29 55.37,15.29 C76.2
CARD_DETECT_A  (via drill 0.2 pad 0.46)
  Top 0.203: U2.P$64 42.11,16.33 42.22,16.43 43.61,16.43 44.02,16.84 44.02,17.3 44.17,17.45 45.31,17.68 v45.74,18.11
  LoSig 0.203: v45.74,18.11 45.16,17.65 44.88,17.17 42.55,17.02 41.86,16.33 21.01,16.33 20.17,17.17 14.68,17.17 14.33,17.07 13.77,16.41 12.65,16.41 12.09,16.92 v12.01,16.92
  Bottom 0.203: v12.01,16.92 12.32,15.47 12.68,13.41 13.72,12.71 J3.CD1
CARD_DETECT_B  (via drill 0.2 pad 0.46)
  Top 0.203: U2.P$65 43.12,16.83 43.43,17.14 43.43,17.5 43.74,17.8 44.86,18.03 44.96,18.24 45.31,18.59 v45.06,19.53
  LoSig 0.203: v45.06,19.53 45.29,18.62 44.78,18.11 41.81,17.5 41.02,16.71 21.77,16.71 19.81,18.01 15.32,18.01 v14.83,17.78
  Bottom 0.203: v14.83,17.78 14.3,17.17 J3.CD2
CAS  (via drill 0.2 pad 0.46)
  Top 0.203: v40.06,21.03 39.32,21.49 38.99,21.51 38.68,21.82 U2.P$74
  LoPwr 0.203: v38.18,19.2 38.3,19.63 38.46,20.07 39.62,20.52 v40.06,21.03
  Bottom 0.203: U7.P$17 37.46,18.87 v38.18,19.2
CHIP_ERASE  (via drill 0.2 pad 0.46)
  Top 0.203: U2.P$87 32.18,21.67 32.28,21.51 32.28,21.03 v32.08,20.47
  LoSig 0.203: v28.73,12.5 25.91,12.5 25.65,12.75 22.78,12.75 22.2,12.09 21.51,12.09 21.08,12.68 20.27,12.68 19.46,11.68 14.28,11.68 14.28,11.18 TP7.P$1
  LoPwr 0.203: v32.08,20.47 31.65,19.58 32.49,18.14 32.49,14.53 31.65,13.69 31.5,13.56 31.06,12.68 31.06,11.63 30.81,11.38 29.84,11.38 v28.73,12.5
  Bottom 0.203: R53.P$2 31.43,19.82 v32.08,20.47
CK  (via drill 0.2 pad 0.46)
  Top 0.203: v40.01,12.5 40.06,12.47 40.41,12.83 U2.P$57
  LoPwr 0.203: v37.8,10.16 37.97,12.17 38.58,12.8 39.32,12.8 v40.01,12.5
  Bottom 0.203: U7.P$38 37.08,7.56 37.29,7.77 37.29,8.48 37.97,9.17 v37.8,10.16
CKE  (via drill 0.2 pad 0.46)
  Top 0.203: v33.71,21.41 33.66,22.36 U2.P$84
  LoSig 0.203: v38.51,9.6 38.71,10.11 38.12,10.72 36.68,10.72 36.45,10.95 33.22,10.95 v33.2,10.97
  LoPwr 0.203: v33.2,10.97 33.2,15.98 33.38,16.15 33.38,20.75 v33.71,21.41
  Bottom 0.203: U7.P$37 37.88,8.36 38.33,8.81 38.35,8.81 38.71,9.17 v38.51,9.6
CS  (via drill 0.2 pad 0.46)
  Top 0.203: v30.2,1.91 30.2,0.8 U2.P$18
  UpGnd 0.203: v30.23,7.75 30.23,1.93 v30.2,1.91
  LoPwr 0.203: v37.72,14.33 37.03,14.1 35.26,12.55 35.26,8.13 34.7,7.57 33.81,7.57 33.45,7.37 30.76,7.37 v30.23,7.75
  Bottom 0.203: U7.P$19 38.68,16.45 v37.72,14.33
D0  (via drill 0.2 pad 0.46)
  Top 0.203: v26.57,2.97 26.67,2.95 26.95,2.18 26.75,1.45 26.75,0.8 26.7,0.8 U2.P$11
  LoPwr 0.203: v25.12,12.14 25.12,5.33 v26.57,2.97
  Bottom 0.203: U7.P$2 25.08,16.27 25.73,15.26 25.73,13.21 v25.12,12.14
D1  (via drill 0.2 pad 0.46)
  Top 0.203: v39.52,3.33 U2.P$38
  LoPwr 0.203: v26.72,14.25 26.75,6.45 27.46,5.74 37.57,5.74 38.15,4.27 v39.52,3.33
  Bottom 0.203: U7.P$4 26.68,16.37 v26.72,14.25
D2  (via drill 0.2 pad 0.46)
  Top 0.203: v40.01,3.94 40.23,3.94 40.34,3.83 U2.P$39
  LoPwr 0.203: v27.58,13.99 27.23,13.64 27.23,6.48 27.84,6.15 38,6.15 38.53,4.55 39.32,4.19 v40.01,3.94
  Bottom 0.203: U7.P$5 27.48,15.74 v27.58,13.99
D3  (via drill 0.2 pad 0.46)
  Top 0.203: U2.P$40 40.55,4.33 40.31,4.57 40.31,4.7 39.95,5.05 v39.12,5.03
  LoPwr 0.203: v39.12,5.03 38.43,6.55 28.04,6.55 27.69,6.71 27.69,13.26 v29.06,14.12
  Bottom 0.203: v29.06,14.12 29.11,17.56 U7.P$7
D4  (via drill 0.2 pad 0.46)
  Top 0.203: v42.39,3.96 42.39,4.52 42.11,4.8 41.26,4.8 U2.P$41
  LoPwr 0.203: v29.13,13.16 28.93,13.16 28.17,13.08 28.17,7.01 28.42,6.99 39.34,6.99 40.69,4.01 42.32,4.01 v42.39,3.96
  Bottom 0.203: U7.P$8 29.88,15.98 29.84,13.21 29.59,13.21 v29.13,13.16
D5  (via drill 0.2 pad 0.46)
  Top 0.203: v39.98,13.31 41.21,13.31 U2.P$58
  UpGnd 0.203: v31.39,14.35 31.57,14.17 31.65,13.31 v39.98,13.31
  Bottom 0.203: U7.P$10 31.45,16.5 v31.39,14.35
D6  (via drill 0.2 pad 0.46)
  Top 0.203: v40.16,11.38 41.18,11.38 U2.P$54
  UpGnd 0.203: v31.98,12.68 37.8,12.68 37.8,12.72 39.19,11.33 40.11,11.33 v40.16,11.38
  Bottom 0.203: U7.P$11 32.28,14.71 v31.98,12.68
D7  (via drill 0.2 pad 0.46)
  Top 0.203: v40.03,8.28 41.18,8.28 U2.P$48
  UpGnd 0.203: v33.93,9.2 34.04,9.17 | 34.09,9.17 34.04,9.17 | 34.04,9.17 34.75,8.97 38.81,8.97 39.24,8.36 39.29,8.31 v40.03,8.28
  LoPwr 0.203: v33.93,14.1 v33.93,9.2
  Bottom 0.203: U7.P$13 33.88,16.39 v33.93,14.1
D8  (via drill 0.2 pad 0.46)
  Top 0.203: v22.84,2.03 22.73,1.85 23.16,1.47 23.19,0.79 U2.P$4
  LoSig 0.203: v33.96,4.39 33.93,4.57 33.78,5.23 30.05,5.23 29.77,4.09 28.7,4.06 27.38,1.27 23.5,1.27 23.19,1.55 v22.84,2.03
  Bottom 0.203: U7.P$42 33.88,4.54 v33.96,4.39
D9  (via drill 0.2 pad 0.46)
  Top 0.203: v24.03,2.08 24.11,2.03 24.18,1.6 U2.P$6
  LoSig 0.203: v32.11,7.95 32.11,8.1 31.5,8.71 30.91,8.71 30.73,8.79 28.85,8.79 28.19,8.23 25.43,8.23 25.02,8.64 25.02,8.81 24.43,8.99 23.55,8.99 v23.39,9.07
  LoPwr 0.203: v23.39,9.07 23.32,8.94 23.14,8.69 23.14,6.73 23.37,6.43 23.57,3.45 24.03,2.92 v24.03,2.08 24.03,2.01
  Bottom 0.203: U7.P$44 32.28,7.78 v32.11,7.95
D10  (via drill 0.2 pad 0.46)
  Top 0.203: v24.71,2.69 24.69,0.79 U2.P$7
  LoSig 0.203: v31.19,8.03 31.04,8.03 30.5,8.41 29.08,8.41 28.37,7.72 25.25,7.72 24.64,8.26 24.54,8.26 v23.93,8.43
  LoPwr 0.203: v23.93,8.43 23.8,8.38 23.52,8.1 23.52,7.01 23.88,6.66 24.03,3.48 v24.71,2.69
  Bottom 0.203: U7.P$45 31.48,7.74 v31.19,8.03
D11  (via drill 0.2 pad 0.46)
  Top 0.203: v26.31,2.03 26.19,1.37 26.19,0.79 U2.P$10
  LoSig 0.203: v29.34,7.75 29.21,7.8 28.73,7.32 24.61,7.32 v24.26,7.67
  LoPwr 0.203: v24.26,7.67 24.26,7.06 24.49,6.83 24.49,5.28 v26.31,2.03
  Bottom 0.203: U7.P$47 29.88,7.18 29.41,7.64 29.41,7.75 v29.34,7.75
D12  (via drill 0.2 pad 0.46)
  Top 0.203: v34.49,2.72 34.44,1.75 34.67,1.52 34.67,0.79 U2.P$27
  LoPwr 0.203: v29.26,4.65 29.44,4.65 29.67,4.98 34.31,4.98 34.59,4.65 v34.49,2.72
  Bottom 0.203: U7.P$48 29.03,5.11 v29.26,4.65
D13  (via drill 0.2 pad 0.46)
  Top 0.203: v35.1,2.01 U2.P$28
  LoPwr 0.203: v26.98,5.03 27.05,5.11 27.1,5.36 35.2,5.36 35.2,2.29 v35.1,2.01
  Bottom 0.203: U7.P$50 27.48,5.46 26.87,4.85 v26.98,5.03
D14  (via drill 0.2 pad 0.46)
  Top 0.203: v39.52,9.09 40.13,9.14 40.44,8.84 U2.P$49
  LoSig 0.203: v26.11,9.65 28.12,9.65 28.37,9.63 32.61,9.63 33.45,9.86 35.94,9.86 36.68,8.89 39.27,8.89 v39.52,9.09
  Bottom 0.203: U7.P$51 26.68,8.22 v26.11,9.65
D15  (via drill 0.2 pad 0.46)
  Top 0.203: v42.7,8.38 42.65,7.06 42.06,6.78 41.28,6.78 U2.P$45
  LoSig 0.203: v25.73,8.87 27.86,8.87 28.68,9.2 31.85,9.2 32.26,8.61 36.02,8.61 36.78,7.85 39.24,7.85 40.03,7.67 42.01,7.67 v42.7,8.38
  Bottom 0.203: U7.P$53 25.08,7.58 25.32,7.82 25.7,7.82 v25.73,8.87
DISABLE_PWR  (via drill 0.2 pad 0.46)
  UpGnd 0.203: v18.31,5.69 19.33,0.43 38.66,0.38 39.52,1.27 40.51,1.27 41.3,0.38 49.89,0.41 57.2,0.38 58.19,0.84 58.42,0.84 59.66,2.08 59.94,2.08 68.63,2.06 68.71,2.06 70.79,1.68 73.61,1.68 73.99,6.15 80.01,6.15 80.21,6.22 80.37,6.33 v80.54,6.71
  LoSig 0.203: v80.54,6.71 82.7,6.71 83.57,6.6 83.9,6.45 84.12,6.25 84.3,6.07 85.7,5.03 86,5.03 TP13.P$1
  Bottom 0.203: IC2.3 v18.31,5.69
  Bottom 0.305: R24.2 20.53,5.48 IC2.3
DM
  Top 0.305: R12.2 C7.1 9.25,9.86 10.92,9.86 11.08,9.57 11.35,9.32 11.5,9.22 D1.P$2 12.03,8.99 13.56,8.81 15.09,8.2 15.65,6.83 U2.P$136
DP
  Top 0.305: U2.P$137 15.44,6.31 14.71,7.06 14.61,7.64 13.59,8.13 13.26,8.28 | 13.26,8.28 11.1,8.28 D1.P$3 8.36,9.56 R11.2 | C13.1 13.34,7.8 13.26,8.28
DVDD_REF  (via drill 0.2 pad 0.46)
  Top 0.203: J2.P10 50.86,12.68 v50.47,12.22
  Bottom 0.203: v50.47,12.22 50.39,12.27 49.91,12.34 49.29,12.17 47.98,13.06 47.6,13.16 C92.2
FRM_GPS
  Bottom 0.203: U24.P$13 TP2.P$1 82.19,8.1 85.42,8.1 85.87,7.65 87.86,5.31 88.37,2.95 U11.P$2
GND  (via drill 0.2 pad 0.46)  (79 unrouted)
  Top 0.203: U2.P$95 28.18,21.73 27.79,21.34 27.79,20.95 27.38,20.55 27.38,19.1 27.53,18.95 29.52,18.95 29.59,19.02 v29.59,19.56 | U2.P$8 25.18,1.29 25.25,1.37 25.25,2.13 25.38,2.67 25.22,3.12 v24.64,3.71 | 40.39,14.48 40.49,14.81 40.69,14.83 U2.P$61 40.59,14.83 40.51,14.76 40.51,14.68 39.78,13.95 39.73,13.95 39.12,13.34 37.31,13.34 v36.14,14.38 | J2.P15 50.42,10.22 50.11,10.92 48.44,10.95 47.83,11.43 47.78,11.86 v47.55,12.04 | 68.15,21.21 v68.15,20.57 | v53.24,11.96 53.14,12.06 53.19,12.12 | U5.P$3 64.19,17.4 64.26,17.3 69.32,17.3 69.65,16.99 69.65,16.25 J5.5__GND 69.79,14.75 v69.72,14.71 | 20.12,7.34 U2.P$135 | C9.2 48.14,20.61 47.68,21.08 47.6,21.08 47.37,21.31 46.61,21.31 46.3,21.01 46.2,20.95 45.9,20.75 45.36,20.75 45.03,21.08 45.03,22.34 F2.2
  Top 0.254: C71.P$2 13.04,4.66 | 12.65,5.11 12.65,6.13 C13.2 | 9.6,11.12 9.6,14.33 7.95,14.33 U6.P$2 | 20.12,7.34 20.95,7.06 20.95,6.43 | U4.P$2 99.92,22.1 99.92,22.73 98.04,22.73 97.66,22.35 v97.66,22.15
  Top 0.305: C70.P$2 13.64,3.35 13.64,4.23 C71.P$2 | v5,6.96 4.78,5.16 4.78,4.57 5,4.57 C5.2 5,2.46 4.72,2.18 4.72,1.7 v4.67,0.69 | C102.2N 9.77,4.71 10.08,5.03 10.08,5.82 C155.P$2 10.29,6.33 10.95,6.63 | 11.38,7.19 D1.P$1 12.94,6.91 C13.2 13.78,6.96 v14.02,7.16 | R6.1 7.16,7.24 7.34,7.04 7.59,6.55 v7.85,6.25 | v10.67,10.59 10.39,10.46 10.24,10.41 10.03,10.44 9.83,10.36 9.93,10.46 C7.2 9.6,10.95 9.6,11.12 | C65.2 4.46,19.53 3.28,19.58 v3.25,19.74 | 13.04,4.66 12.65,5.11 | U6.P$8 15.75,12.8 v16.28,12.9 16.38,11.61 R37.1 | 19.25,17.35 19.24,17.33 U2.P$115 20.31,17.33 20.6,17.04 | v20.6,2.31 20.57,2.29 20.83,2.52 | v22.25,4.8 22.25,4.9 | 45.41,5.08 45.54,4.95 v45.54,4.67 45.64,4.78 46.63,4.78 46.86,5 46.86,6.2 47.14,6.48 B1.N | 73.86,12.21 C18.2 | 10.06,18.14 v10.13,18.82 | v102.51,17.98 103.07,19.53 104.62,19.53 U1.P$3 105.56,21.54 C28.2 | J1.P$3 J1.P$5 71.91,4.12 v73.18,4.45 | C16.2 75.35,11.95 75.08,11.94 75.44,11.91 75.89,11.61 75.26,11.89 75.11,12.06 C18.2 | C18.2 76.1,11.73 PIR2.VSS | v49.12,21.44 48.62,20.65 C9.2 48.48,20.59 | C44.2 84.9,18.63 IC7.2 82.3,19.36 v82.22,19.28 | C6.2 79.12,20.36 TP8.P$1 | J7.P$1 59.66,16.23 | J2.P$28 56.77,18.47 56.77,18.8 57.58,18.8 | U4.P$2 99.97,22.68 100.03,22.73
  Top 0.406: 11.38,7.19 10.95,6.63
  UpGnd 0.254: v97.66,22.15 97.69,22.17 97.69,22.33
  UpGnd 0.305: v74.22,8.99 74.19,8.99 74.19,8.97
  UpGnd 0.406: v102.16,21.08 102.06,21.18 102.03,21.18 | v57.78,19.43 55.17,19.43 v53.21,17.48
  LoSig 0.406: v70.74,8.56 71.53,9.35 | 71.53,9.35 73.81,9.4 v74.22,8.99 | 71.53,9.35 71.53,9.86 70.51,10.87 70.51,13.92 v69.72,14.71
  LoPwr 0.305: 53.39,17.42 v53.21,17.48 | 53.39,12.06 v53.24,11.96
  LoPwr 0.406: 53.39,12.06 53.39,17.42 | v57.78,19.43 57.58,19.43 56.74,20.27 56.74,21.46 57.45,22.17 59.82,22.17 60.73,20.73 64.97,20.7 66.06,20.22 67.31,20.22 67.82,20.42 68.07,20.55 v68.15,20.57
  Bottom 0.203: v24.64,3.71 24.64,4.01 24.89,4.27 24.89,4.7 C64.2 | R53.P$1 29.76,19.73 v29.59,19.56 | v36.14,14.38 36.2,14.43 36.27,14.35 | v47.55,12.04 47.52,11.02 48.69,11.02 | C76.1 53.27,17.21 v53.21,17.48 | C35.2 R39.1 | J3.G1 1.41,19.19 1.32,19.28 1.07,19.28 1.02,19.33 | C45.2 102.54,17.7 102.39,17.93 v102.51,17.98 | 56.56,12.5 56.41,12.65 53.7,12.65 53.59,12.55 53.59,12.37 v53.24,11.96 | v69.72,14.71 69.75,13.01
  Bottom 0.254: C64.2 24.98,4.79
  Bottom 0.305: C29.P$2 5.82,4.22 7.04,4.22 7.52,4.37 7.91,4.39 R62.1 7.75,4.96 v7.85,6.25 | U19.2 9.27,2.16 9.2,2.29 9.07,2.33 U9.P$6 5.96,2.25 U9.P$9 4.9,1.19 v4.67,0.69 | J3.6_VSS 0.63,8.97 0.43,8.66 0.41,6.63 0.53,6.27 0.71,5.61 | 0.71,5.61 0.68,5.49 J3.G4 3.9,6.17 4.37,6.38 v5,6.96 | C21.2 1.64,5.6 0.71,5.61 | v10.67,10.59 10.36,10.46 | C20.2 2.11,20.92 C19.2 2.44,21.32 v3.25,19.74 | J3.G3 12.71,6.9 12.7,6.91 13.64,6.91 v14.02,7.16 | C88.2 15.32,10.57 15.47,10.67 15.39,10.49 v16.28,12.9 | Q8.5 20.42,2.39 v20.6,2.31 | C87.2 22.35,5.44 22.25,5.33 v22.25,4.8 | C2.2 24.37,20.41 C38.2 | U7.P$54 24.28,5.71 C64.2 25.88,5.68 U7.P$52 | C67.2 29.84,3.62 30.61,4.39 30.61,4.72 30.66,4.78 | 30.66,4.78 31.43,4.78 C8.2 | U7.P$46 30.68,4.8 30.66,4.78 | U7.P$28 45.08,5.57 45.34,5.31 45.34,4.88 v45.54,4.67 | v10.13,18.82 9.58,20.3 | U24.P$25 75.67,4.42 U24.P$3 73.79,4.45 v73.18,4.45 | C27.2 v108.46,21.29 | U11.P$10 102.31,11.12 C43.P$1 | 49.28,21.31 49.23,21.41 v49.12,21.44 | IC3.2 83.94,19.28 v82.22,19.28 | R39.1 73.84,9.31 v74.22,8.99 | R45.1 102.69,16.05 | 102.69,16.05 102.77,15.98 102.77,15.36 C34.2 | C45.2 102.83,16.2 102.69,16.05
  Bottom 0.406: U11.P$12 102.89,8.26 G2.P$1 | U11.P$10 v101.5,11.99 | 67.26,19.68 v68.15,20.57 68.15,20.98 67.36,21.77 66.12,21.77 | 74.09,9.07 v74.22,8.99 | C3.2 101.64,21.36 v102.16,21.08
  pour Top: 0.3,22.83 108.58,22.83 108.89,0.41 68.94,0.38 68.91,0.38 57.94,0.36 0.25,0.36
  pour Bottom: 0.18,22.86 44.12,22.86 44.68,22.91 108.71,22.53 108.61,0.25 68.4,0.3 68.35,0.3 57.99,0.36 58.01,0.33 0.28,0.28
GPS1
  Bottom 0.406: U11.P$11 L5.P$2 104.04,9.32 104.04,7.77 G2.P$3
GPS_RESET  (via drill 0.2 pad 0.46)
  LoPwr 0.203: v74.85,8.48 79.22,6.04 82.02,5.23 82.63,5.92 86.89,5.92 90.65,9.68 v91.16,11.76
  Bottom 0.203: U24.P$5 73.71,5.51 73.46,5.97 v74.85,8.48 | v91.16,11.76 91.66,10.75 U11.P$9
GPS_VCC_X  (via drill 0.2 pad 0.46)
  Top 0.305: R15.1 v87.07,17.65
  LoPwr 0.305: v87.07,17.65 87.15,17.58 89.41,17.58 90.17,16.31 91.85,16.31 92.13,16.33 100.99,16.33 104.72,14.43 v104.72,12.01
  Bottom 0.305: C43.P$2 v104.72,12.01 L5.P$1
  Bottom 0.406: U11.P$7 90.5,8.48 90.47,9.68 U11.P$8 90.45,9.73 87.68,13.08 v87.07,17.65
GPSPWRC  (via drill 0.2 pad 0.46)
  UpGnd 0.203: v75.89,1.27 76.33,0.38 81,0.38 82.07,1.27 81.05,6.2 81.66,7.24 81.74,7.26 86.21,8.05 86.21,14.48 85.8,14.83 85.72,17.5 85.72,17.63 v85.7,21.59
  Bottom 0.203: U24.P$22 76.2,1.6 v75.89,1.27 | v85.7,21.59 IC3.3
ISI_D0  (via drill 0.2 pad 0.46)
  Top 0.203: J2.P19 50.65,8.08 50.47,8 v50.39,5.71 | v42.29,14.53 41.26,14.3 U2.P$60
  LoSig 0.203: v50.39,5.71 50.52,6.53 50.09,8.1 49.45,8.69 45.95,8.69 44.63,10.44 44.25,10.9 44.25,12.68 43.1,13.16 42.65,14.17 42.34,14.45 v42.29,14.53
ISI_D1  (via drill 0.2 pad 0.46)
  Top 0.203: J2.P21 51.98,7.18 v53.01,6.68 | v43.38,14.05 42.57,15.24 41.81,15.82 U2.P$63
  LoSig 0.203: v53.01,6.68 51.26,6.83 51.21,8.38 49.63,9.25 46.2,9.25 44.91,10.85 44.68,11.15 44.68,12.88 43.23,14.2 v43.38,14.05
ISI_D2  (via drill 0.2 pad 0.46)
  Top 0.203: J2.P22 52.04,6.68 52.22,6.6 52.25,5.31 v50.49,4.93 | v36.83,2.06 36.7,1.85 36.68,1.45 U2.P$31
  LoPwr 0.203: v50.49,4.93 50.52,4.06 50.06,3.35 47.68,3.35 46.74,2.46 38.96,2.46 38.46,2.85 37.64,3.05 37.11,2.79 37.03,2.26 v36.83,2.06
ISI_D3  (via drill 0.2 pad 0.46)
  Top 0.203: J2.P20 52.03,7.68 v52.45,7.59 | v38.86,20.88 38.15,21.77 38.15,22.35 U2.P$75
  UpGnd 0.203: v44.15,21.57 43.71,21.97 43.64,22 39.29,22.02 v38.86,20.88
  LoPwr 0.203: v52.45,7.59 53.52,7.34 54.89,10.41 54.97,22.89 45.24,22.89 v44.15,21.57
ISI_D4  (via drill 0.2 pad 0.46)
  Top 0.203: J2.P18 52.14,8.65 v53.16,8 | v40.84,21.34 40.89,22.37 U2.P$73
  UpGnd 0.203: v45.92,21.51 45.7,21.26 45.29,20.65 43.92,20.65 42.75,21.46 v40.84,21.34
  LoPwr 0.203: v53.16,8 53.72,8.79 54.38,10.36 54.38,21.06 54.33,21.03 53.75,22.53 45.95,22.53 v45.92,21.51
ISI_D5  (via drill 0.2 pad 0.46)
  Top 0.203: J2.P16 52.4,9.65 v52.81,10.34 | v26.67,21.31 U2.P$98
  UpGnd 0.203: v52.81,10.34 52.48,10.16 52.27,10.11 49.58,10.11 48.49,9.02 45.82,9.02 44.73,10.11 42.09,10.11 41.12,10.59 39.37,10.62 38.2,11.79 37.87,12.06 37.49,12.09 31.14,12.04 30.91,12.06 30.84,12.06 v30.45,12.09
  LoPwr 0.203: v30.45,12.09 29.74,15.04 25.76,17.25 25.38,20.3 26.47,20.98 v26.67,21.31
ISI_D6  (via drill 0.2 pad 0.46)
  Top 0.203: J2.P14 51.98,10.65 52.15,10.65 52.35,10.95 53.29,10.95 v53.29,10.97 | v28.88,20.83 29.41,21.49 29.69,21.77 29.69,22.37 U2.P$92
  LoPwr 0.203: v53.29,10.97 53.34,11 53.9,11.56 53.87,20.62 51.77,20.62 51.23,20.27 50.67,20.27 49.96,20.93 49.94,21.13 49.68,22.12 47.4,22.12 46.23,20.95 43.97,20.95 41.99,22.78 30.13,22.78 29.22,22.38 29.22,21.63 29.18,21.59 29.01,21.11 v28.88,20.83
ISI_D7_SDDAT3  (via drill 0.2 pad 0.46)
  Top 0.203: J2.P12 v52.42,11.58 v52.43,11.58 | v43.08,19.91 42.95,19.23 42.72,19.05 42.11,18.97 41.88,19.28 U2.P$70 | R30.1 2.05,16.93 3.1,16.92 3.63,16.28 3.89,16.05 4.67,16.05 v5.41,15.85
  LoSig 0.203: v52.43,11.58 52.43,11.79 51.18,12.68 51.28,14.25 51.23,14.68 49.33,14.71 48.11,15.62 46.08,16.51 46.08,16.48 | v43.08,19.91 44.09,20.3 45.59,20.3 45.67,19.13 46.48,18.16 46.08,16.48 | v5.41,15.85 5.46,15.88 5.66,15.93 8.03,15.93 13.92,15.93 14.71,16.71 19.89,16.71 20.68,15.93 42.16,15.88 42.77,16.48 46.08,16.48
  Bottom 0.203: J3.2_CD_DAT3 2.17,13.4 2.67,13.97 2.69,14.63 v5.41,15.85
ISI_MCK  (via drill 0.2 pad 0.46)
  Top 0.203: J2.P13 50.67,11.21 v49.89,11.66 | v37.72,2.36 37.24,1.57 U2.P$32
  LoPwr 0.203: v49.89,11.66 50.85,11.28 51.33,10.79 51.33,4.04 50.47,2.9 48.16,2.9 47.07,2.03 37.9,2.03 v37.72,2.36
ISI_PCK  (via drill 0.2 pad 0.46)
  Top 0.203: R13.P$2 v46.51,12.04 | v43.54,12.17 43.08,12.17 42.88,12.37 41.27,12.37 U2.P$56
  LoPwr 0.203: v46.51,12.04 44.02,11.94 v43.54,12.17
LDM  (via drill 0.2 pad 0.46)
  Top 0.203: v20.78,19.33 U2.P$111
  UpGnd 0.203: v35.13,18.87 35.08,18.69 34.57,17.55 22.78,17.55 v20.78,19.33
  Bottom 0.203: U7.P$15 35.43,18.52 v35.13,18.87
LED
  Top 0.203: U2.P$1 21.68,0.5 21.51,0.38 12.65,0.36 12.47,0.53 12.47,0.55 LED1.C
LRW_DAT
  Top 0.203: U2.P$117 18.82,16.41 TP1.P$1
LRW_PWRC  (via drill 0.2 pad 0.46)
  Top 0.203: U2.P$37 41.62,2.83 42.01,2.44 42.93,2.44 42.95,2.41 43.28,2.74 43.28,3.25 v43.51,3.48 | v82.12,20.27 82.48,20.3 IC7.3
  UpGnd 0.203: v43.51,3.48 43.92,3.48 44.42,3.83 47.3,3.83 49.02,3.48 51.46,3.83 52.07,5.79 54.44,6.18 | 54.44,6.18 56.72,6.55 56.95,7.32 56.11,9.65 56.13,10.06 54.84,11.58 54.84,16.56 56.08,17.83 58.73,18.14 60.53,18.14 62.2,18.95 70.59,18.92 71.25,19 75.74,19.02 78.66,19.02 79.78,20.04 81.71,20.04 81.94,20.27 v82.12,20.27 | J7.P$2 58.65,12.39 58.55,6.93 v58.52,6.48 | v54.97,6.35 54.44,6.18
  Bottom 0.203: v58.52,6.48 v54.97,6.35
N$1  (via drill 0.2 pad 0.46)
  Top 0.203: U6.P$14 9.14,20.37 v9.3,18.62 | v11.84,14.33 U6.P$5
  LoPwr 0.203: v9.3,18.62 9.32,18.47 9.58,16.74 v11.84,14.33
N$2  (via drill 0.2 pad 0.46)
  Top 0.203: v24.66,21.31 24.66,22.37 U2.P$102
  LoSig 0.203: v40.13,18.87 40.01,18.26 39.57,17.55 25.25,17.58 v24.66,21.31
  Bottom 0.203: U7.P$21 40.28,18.68 v40.13,18.87
N$3
  Top 0.203: R40.1 58.09,3.08 D4.2_A
  Top 0.305: D4.2_A 58.14,3.38 J7.P$6
N$4  (via drill 0.2 pad 0.46)
  Top 0.203: U2.P$20 31.18,1.49 31.42,1.73 31.42,2.39 31.37,2.85 31.37,3.5 v31.24,3.73 | 74.93,17.35 72.85,17.07 72.54,13.08 71.65,11.99 71.83,10.95 72.67,10.97 72.8,10.82 73.03,9.68 74.32,9.68 75.46,8.87 75.46,7.95 74.98,6.78 74.98,1.27 v75.08,1.17
  Top 0.305: J5.2_RST_PGM 76.05,19.64 76.05,18.44 74.95,17.35 74.93,17.35
  UpGnd 0.203: v31.24,3.73 31.24,4.22 33.35,6.58 33.35,6.76 35.15,8.61 38.48,8.61 39.27,7.72 42.52,7.72 43.16,7.09 48.72,7.09 50.75,8.94 53.87,8.94 v55.55,7.59
  LoPwr 0.203: v75.08,1.17 74.6,1.17 74.14,1.35 68.78,1.35 68.76,4.12 68.45,4.32 68.25,4.47 59,4.45 58.65,5.18 56.72,5.18 55.73,5.28 v55.55,7.59
  Bottom 0.203: U24.P$23 75.7,1.97 v75.08,1.17
N$5  (via drill 0.2 pad 0.46)
  Top 0.203: U2.P$89 31.18,21.68 31.04,21.54 31.04,20.8 v30.86,20.57 30.76,20.73 | J1.P$4 70.05,8.33 68.15,8.51 68.15,16.59 61.75,16.59 61.77,20.95 61.77,20.98 62.31,21.64 62.31,22.5 62.41,22.53 v63.86,22.55
  LoSig 0.203: v63.86,22.55 63.63,22.63 63.58,22.89 30.81,22.91 30.61,22.55 30.61,20.83 v30.86,20.57
N$6  (via drill 0.2 pad 0.46)
  Top 0.305: v88.37,18.77 87.66,19.68 R15.2 C44.1
  Bottom 0.305: IC3.5 v88.37,18.77 88.88,18.77 91.31,16.33 94.16,16.33 97.51,17.04 C45.1
N$7  (via drill 0.2 pad 0.46)
  Top 0.203: v23.8,21.03 23.5,21.41 23.19,21.72 U2.P$105 | J1.P$8 72.49,9.07 72.49,10.46 71.09,10.49 71.09,12.29 71.96,13.03 72.03,16.97 70.21,16.97 70.21,17.6 70.23,22.02 68.3,22.73 65.41,22.73 v65.02,22.12
  LoSig 0.203: v23.8,21.03 23.85,20.98 23.85,20.52 24.38,19.61 24.38,17.88 25.15,17.12 39.85,17.12 41.55,18.82 41.55,20.68 41.83,21.16 43.16,22.12 60.4,22.12 61.14,21.26 64.67,21.26 v65.02,22.12
N$8  (via drill 0.2 pad 0.46)
  Top 0.203: v20.83,20.24 20.75,20.24 20.62,20.37 19.67,20.37 U2.P$109 | J1.P$6 71.6,9.17 68.56,9.17 68.58,16.94 62.13,16.94 62.13,20.62 v62.87,21.82
  UpGnd 0.203: v62.87,21.82 62.56,21.26 61.16,20.09 61.11,20.09 61.01,20.07 60.1,18.92 58.34,18.87 55.65,18.8 53.95,17.12 53.95,10.64 53.37,9.73 50.01,9.73 48.87,8.59 45.57,8.59 44.42,9.73 41.07,9.73 40.23,10.06 39.4,10.06 37.87,11.58 35.38,11.58 33.96,10.16 28.57,10.16 27.76,10.97 27.76,11.96 25.63,13.34 24.33,13.87 v23.67,14.4
  LoPwr 0.203: v23.67,14.4 23.67,19.05 22.38,20.34 20.93,20.34 v20.83,20.24
N$9  (via drill 0.2 pad 0.46)
  Top 0.203: U2.P$79 36.18,21.4 v36.02,21.01 | J1.P$2 67.74,7.64 67.79,16.2 61.39,16.2 61.39,21.11 61.7,21.57 v61.72,21.84
  UpGnd 0.203: v61.72,21.84 55.73,22.05 v52.83,19.99
  LoPwr 0.203: v36.02,21.01 36.07,21.16 37.19,21.92 41.66,21.92 43.79,20.12 45.54,20.12 45.77,19.3 45.95,18.82 47.04,17.37 50.77,17.5 v52.83,19.99
N$10  (via drill 0.2 pad 0.46)
  UpSig 0.305: v18.39,13.08 18.49,13.28
  Bottom 0.305: v18.39,13.08 18.39,13.06 R5.2 16.2,11.01 16.18,9.58 15.91,9.14 C88.1 15.49,8.38 IC2.5
N$11  (via drill 0.2 pad 0.46)
  Top 0.305: IC7.5 80.74,18.58 C6.1 78.19,17.58 v78.03,17.58
  UpGnd 0.305: v56.08,12.09 56.82,12.09 57.68,12.95 58.75,14.43 60.35,14.43 70.28,13.84 74.3,13.79 75.72,14.48 77.6,17.14 v78.03,17.58
N$12
  Bottom 0.305: U24.P$4 73.64,4.95 73.13,5.44 71.98,6.73 R16.1
N$14
  Top 0.203: R29.1 2.4,21.07 1.85,21.61 1.58,21.61 LED2.1_A
N$15  (via drill 0.2 pad 0.46)
  Top 0.305: R17.2 53.56,1.84 53.54,3.58 52.78,3.68 v52.76,3.96
  LoSig 0.305: 52.88,4.09 v52.76,3.96 52.78,3.99 57.05,3.99 57.33,3.71 v60.02,3.71
  Bottom 0.254: 52.88,4.01 v52.76,3.96
  Bottom 0.305: IC1.1 65.81,9.81 66.19,9.37 66.19,6.35 64.49,6.27 62.61,6.27 v60.02,3.71
  Bottom 0.406: 52.88,4.01 F1.1
N$16
  Bottom 0.305: IC6.5 4.55,22.06 R19.2 C19.1 1.63,22.32 C20.1
N$17
  Bottom 0.305: R23.2 48.77,4.07 48.72,3.99 48.04,3.31 IC5.5 C15.1
N$18
  Top 0.203: R43.1 10.08,1.44 LED1.A
N$19
  Bottom 0.203: 83.36,15.57 82.49,15.57 D2.K
  Bottom 0.254: U11.P$6 89.92,7.82 89.69,9.42 86.54,13.18 84.91,15.52 83.36,15.57
N$20  (via drill 0.2 pad 0.46)
  LoPwr 0.203: v66.02,0.58 66.06,0.56 66.55,0.36 86.28,0.38 88.8,2.9 93.65,10.72 93.65,13.4 PIR1.SI
  Bottom 0.203: TP6.P$1 74.16,3.22 U24.P$1 74.35,3.26 73.89,2.79 68.45,2.79 v66.02,0.58
N$21  (via drill 0.2 pad 0.46)